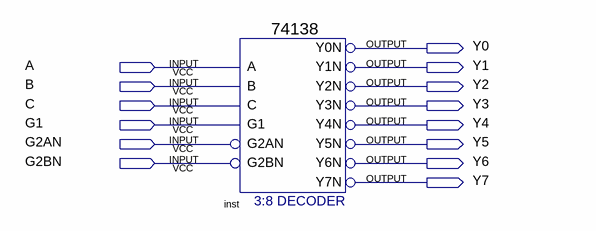
[diagram p0: schematic sheet]
// Quartus schematic a74138a.bdf as structural Verilog: 1 symbols, 14 pins
module a74138a (
  input  A,
  input  B,
  input  C,
  input  G1,
  input  G2AN,
  input  G2BN,
  output Y0,
  output Y1,
  output Y2,
  output Y3,
  output Y4,
  output Y5,
  output Y6,
  output Y7
);

  \74138  inst (
    .A(A), .B(B), .G1(G1), .C(C), .G2AN(G2AN), .G2BN(G2BN), .Y0N(Y0), .Y1N(Y1), .Y2N(Y2), .Y3N(Y3), .Y4N(Y4),
    .Y5N(Y5), .Y6N(Y6), .Y7N(Y7));
endmodule
